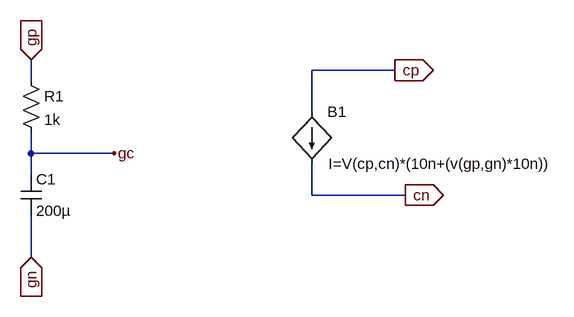
[diagram p0: schematic Capteur.asc]
Capteur.asc, the LTspice schematic file:
Version 4
SHEET 1 11528 17624
WIRE 11280 17248 11152 17248
WIRE 10720 17264 10720 17232
WIRE 11152 17312 11152 17248
WIRE 10720 17376 10720 17344
WIRE 10848 17376 10720 17376
WIRE 10720 17408 10720 17376
WIRE 11152 17440 11152 17392
WIRE 11296 17440 11152 17440
WIRE 10720 17536 10720 17472
FLAG 10720 17536 gn
IOPIN 10720 17536 In
FLAG 10720 17232 gp
IOPIN 10720 17232 In
FLAG 10848 17376 gc
FLAG 11280 17248 cp
IOPIN 11280 17248 Out
FLAG 11296 17440 cn
IOPIN 11296 17440 Out
SYMBOL res 10704 17248 R0
SYMATTR InstName R1
SYMATTR Value 1k
SYMBOL cap 10704 17408 R0
SYMATTR InstName C1
SYMATTR Value 200µ
SYMBOL bi 11152 17312 R0
WINDOW 3 372 80 Right 2
SYMATTR Value I=V(cp,cn)*(10n+(v(gp,gn)*10n))
SYMATTR InstName B1

The netlist it stands for:
* Capteur.asc
R1 gp gc 1k
C1 gc gn 200µ
B1 cp cn I=V(cp,cn)*(10n+(v(gp,gn)*10n))
.backanno
.end